# Altium schematic sheet P16 Hi3531AV100(RGMII&I.SchDoc
size 420 x 297 mm
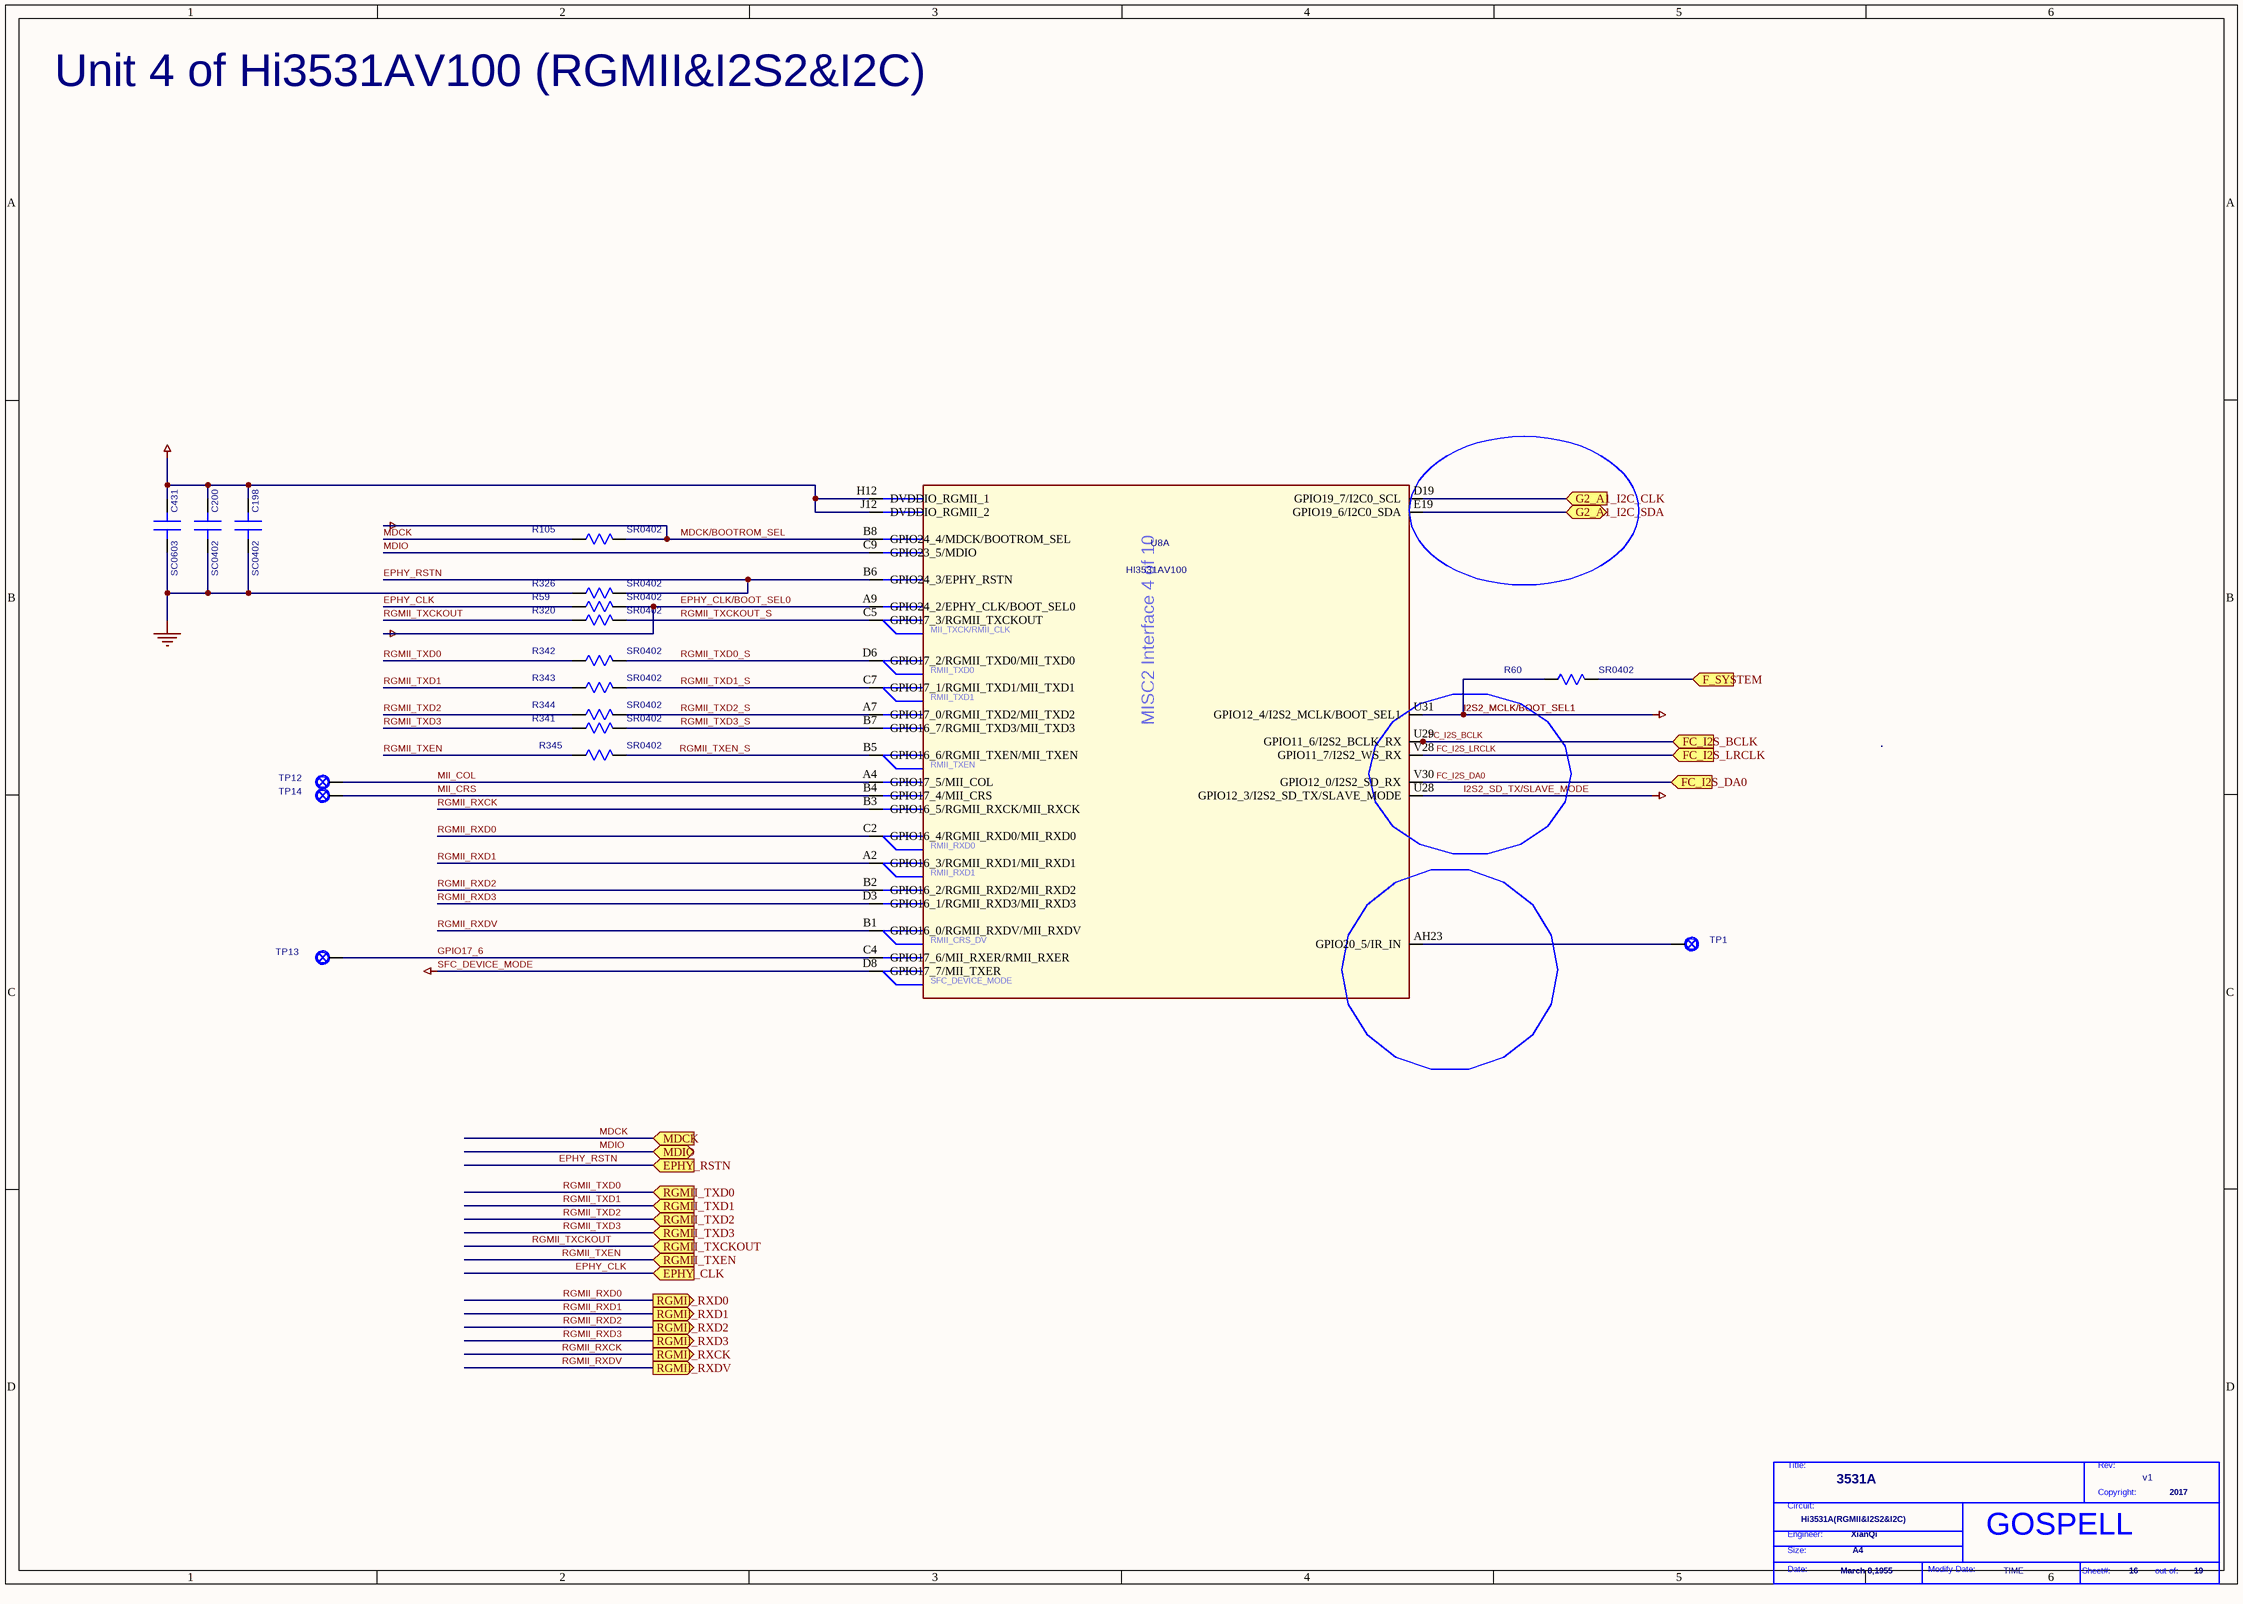
[diagram p0: P16 Hi3531AV100(RGMII&I.SchDoc]

## Parts
*  Page Modify Date: TIME  Engineer: XianQi  Copyright: 2017  Title: 3531A  RevCode: v1  Page Size: A4  Page Create Date: March 8,1955  Page Number: 16  Page Count: 19  Doc: Hi3531A(RGMII&I2S2&I2C)  (hidden comment: GOSPELL)  (graphical)
C198  SC0402  [SC0402]
C200  SC0402  [SC0402]
C431  SC0603  [SC0603]
R59  SR0402  [SR0402]
R60  SR0402  [SR0402]
R105  SR0402  [SR0402]
R320  SR0402  [SR0402]
R326  SR0402  [SR0402]
R341  SR0402  [SR0402]
R342  SR0402  [SR0402]
R343  SR0402  [SR0402]
R344  SR0402  [SR0402]
R345  SR0402  [SR0402]
TP1  TP24-SMD  [TP24-SMD]  (value not drawn)
TP12  TP24-SMD  [TP24-SMD]  (value not drawn)
TP13  TP24-SMD  [TP24-SMD]  (value not drawn)
TP14  TP24-SMD  [TP24-SMD]  (value not drawn)
U8  DEVICE: HI3531AV100  [BGA805-32-3333]  (hidden comment: BGA805-32-3333)  (part A of 10)

## Ports
EPHY_CLK (in), EPHY_RSTN (in), F_SYSTEM (in), FC_I2S_BCLK (in), FC_I2S_DA0 (in), FC_I2S_LRCLK (in), G2_A1_I2C_CLK (in), G2_A1_I2C_SDA (bidir), MDCK (in), MDIO (bidir), RGMII_RXCK (out), RGMII_RXD0 (out), RGMII_RXD1 (out), RGMII_RXD2 (out), RGMII_RXD3 (out), RGMII_RXDV (out), RGMII_TXCKOUT (in), RGMII_TXD0 (in), RGMII_TXD1 (in), RGMII_TXD2 (in), RGMII_TXD3 (in), RGMII_TXEN (in)

## Nets
3V3: C198.1(A) C200.1(A) C431.1(A) U8.H12(DVDDIO_RGMII_1) U8.J12(DVDDIO_RGMII_2)
EPHY_CLK/BOOT_SEL0: R59.2(B) U8.A9(GPIO24_2/EPHY_CLK/BOOT_SEL0)
GND: C198.2(B) C200.2(B) C431.2(B) R326.1(A)
I2S2_MCLK/BOOT_SEL1: R60.1(A) U8.U31(GPIO12_4/I2S2_MCLK/BOOT_SEL1)
I2S2_SD_TX/SLAVE_MODE: U8.U28(GPIO12_3/I2S2_SD_TX/SLAVE_MODE)
MDCK/BOOTROM_SEL: R105.2(B) U8.B8(GPIO24_4/MDCK/BOOTROM_SEL)
SFC_DEVICE_MODE: U8.D8(GPIO17_7/MII_TXER)
EPHY_CLK: R59.1(A) ; port EPHY_CLK
EPHY_RSTN: R326.2(B) U8.B6(GPIO24_3/EPHY_RSTN) ; port EPHY_RSTN
F_SYSTEM: R60.2(B) ; port F_SYSTEM
FC_I2S_BCLK: U8.U29(GPIO11_6/I2S2_BCLK_RX) ; port FC_I2S_BCLK
FC_I2S_DA0: U8.V30(GPIO12_0/I2S2_SD_RX) ; port FC_I2S_DA0
FC_I2S_LRCLK: U8.V28(GPIO11_7/I2S2_WS_RX) ; port FC_I2S_LRCLK
G2_A1_I2C_CLK: U8.D19(GPIO19_7/I2C0_SCL) ; port G2_A1_I2C_CLK
G2_A1_I2C_SDA: U8.E19(GPIO19_6/I2C0_SDA) ; port G2_A1_I2C_SDA
GPIO17_6: TP13.1 U8.C4(GPIO17_6/MII_RXER/RMII_RXER)
MDCK: R105.1(A) ; port MDCK
MDIO: U8.C9(GPIO23_5/MDIO) ; port MDIO
MII_COL: TP12.1 U8.A4(GPIO17_5/MII_COL)
MII_CRS: TP14.1 U8.B4(GPIO17_4/MII_CRS)
RGMII_RXCK: U8.B3(GPIO16_5/RGMII_RXCK/MII_RXCK) ; port RGMII_RXCK
RGMII_RXD0: U8.C2(GPIO16_4/RGMII_RXD0/MII_RXD0) ; port RGMII_RXD0
RGMII_RXD1: U8.A2(GPIO16_3/RGMII_RXD1/MII_RXD1) ; port RGMII_RXD1
RGMII_RXD2: U8.B2(GPIO16_2/RGMII_RXD2/MII_RXD2) ; port RGMII_RXD2
RGMII_RXD3: U8.D3(GPIO16_1/RGMII_RXD3/MII_RXD3) ; port RGMII_RXD3
RGMII_RXDV: U8.B1(GPIO16_0/RGMII_RXDV/MII_RXDV) ; port RGMII_RXDV
RGMII_TXCKOUT: R320.1(A) ; port RGMII_TXCKOUT
RGMII_TXCKOUT_S: R320.2(B) U8.C5(GPIO17_3/RGMII_TXCKOUT)
RGMII_TXD0: R342.1(A) ; port RGMII_TXD0
RGMII_TXD0_S: R342.2(B) U8.D6(GPIO17_2/RGMII_TXD0/MII_TXD0)
RGMII_TXD1: R343.1(A) ; port RGMII_TXD1
RGMII_TXD1_S: R343.2(B) U8.C7(GPIO17_1/RGMII_TXD1/MII_TXD1)
RGMII_TXD2: R344.1(A) ; port RGMII_TXD2
RGMII_TXD2_S: R344.2(B) U8.A7(GPIO17_0/RGMII_TXD2/MII_TXD2)
RGMII_TXD3: R341.1(A) ; port RGMII_TXD3
RGMII_TXD3_S: R341.2(B) U8.B7(GPIO16_7/RGMII_TXD3/MII_TXD3)
RGMII_TXEN: R345.1(A) ; port RGMII_TXEN
RGMII_TXEN_S: R345.2(B) U8.B5(GPIO16_6/RGMII_TXEN/MII_TXEN)
NetTP1_1: TP1.1 U8.AH23(GPIO20_5/IR_IN)

## Notes on the sheet
- Unit 4 of Hi3531AV100 (RGMII&I2S2&I2C)
- (in symbol GOSPELL) Title:; Rev:; Copyright:; Circuit:; Engineer:; Size:; Date:; Modify Date:; Sheet#:; out of:
- (in symbol HI3531AV100_M2_17, part A) MII_TXCK/RMII_CLK; RMII_TXD0; RMII_TXD1; MISC2 Interface 4 of 10; RMII_TXEN; RMII_RXD0; RMII_RXD1; RMII_CRS_DV; SFC_DEVICE_MODE

## Library data of the parts
C198 = C_0_Dup2: PARTS: 1; PINSWAP: (A,B); LEVEL: STD; DEVICE: RMEMK105BJ104KV_FR; OriginalSymbolOrigin: (0,30); %208%%161%%192%%224%%195%%251%%179%%198%: SMD陶瓷电容; COMPONENT_HIGH_MAX: 0.55MM; %182%%238%%182%%168%%185%%164%%215%%247%%181%%231%%209%%185%(V): 16; %195%%232%%202%%246%: SMD陶瓷电容-16V-100NF-+/-10%-X7R-0402-BT; CODE: 8070614; PKG_TYPE: SC0402
C200 = C_0_Dup2: PARTS: 1; PINSWAP: (A,B); LEVEL: STD; DEVICE: RMEMK105BJ104KV_FR; OriginalSymbolOrigin: (0,30); CODE: 8070614; %195%%232%%202%%246%: SMD陶瓷电容-16V-100NF-+/-10%-X7R-0402-BT; %182%%238%%182%%168%%185%%164%%215%%247%%181%%231%%209%%185%(V): 16; COMPONENT_HIGH_MAX: 0.55MM; %208%%161%%192%%224%%195%%251%%179%%198%: SMD陶瓷电容; PKG_TYPE: SC0402
C431 = C_0_Dup2: PARTS: 1; PINSWAP: (A,B); LEVEL: STD; DEVICE: C1608X5R0J106MT0A0E; OriginalSymbolOrigin: (0,30); %208%%161%%192%%224%%195%%251%%179%%198%: SMD陶瓷电容; COMPONENT_HIGH_MAX: 0.9MM; %182%%238%%182%%168%%185%%164%%215%%247%%181%%231%%209%%185%(V): 6.3; %195%%232%%202%%246%: SMD陶瓷电容-6.3V-10000NF-+/-20%-X5R-0603-BT,TS16949; CODE: 8070649; PKG_TYPE: SC0603
R59 R105 R320 R344 = R_1: PARTS: 1; LEVEL: STD; DEVICE: RC0402FR_0733RL; PINSWAP: (A,B); OriginalSymbolOrigin: (10,20); %208%%161%%192%%224%%195%%251%%179%%198%: 片式厚膜电阻器; COMPONENT_HIGH_MAX: 0.4MM; %215%%232%%214%%181%%212%%202%%208%%237%%198%%171%%178%%238%: +/-1%; %182%%238%%182%%168%%185%%166%%194%%202%(W): 0.06; %195%%232%%202%%246%: 片式厚膜电阻器-0.0625W-33OHM-+/-1%-0402; CODE: 7090836; PKG_TYPE: SR0402
R60 R341-R343 R345 = R_1: PARTS: 1; LEVEL: STD; DEVICE: RC0402FR_0733RL; PINSWAP: (A,B); OriginalSymbolOrigin: (10,20); CODE: 7090836; %195%%232%%202%%246%: 片式厚膜电阻器-0.0625W-33OHM-+/-1%-0402; %182%%238%%182%%168%%185%%166%%194%%202%(W): 0.06; %215%%232%%214%%181%%212%%202%%208%%237%%198%%171%%178%%238%: +/-1%; COMPONENT_HIGH_MAX: 0.4MM; %208%%161%%192%%224%%195%%251%%179%%198%: 片式厚膜电阻器; PKG_TYPE: SR0402
R326 = R_1: PARTS: 1; LEVEL: STD; DEVICE: RC0402FR_071KL; PINSWAP: (A,B); OriginalSymbolOrigin: (10,20); %208%%161%%192%%224%%195%%251%%179%%198%: 片式厚膜电阻器; COMPONENT_HIGH_MAX: 0.4MM; %215%%232%%214%%181%%212%%202%%208%%237%%198%%171%%178%%238%: +/-1%; %182%%238%%182%%168%%185%%166%%194%%202%(W): 0.06; %195%%232%%202%%246%: 片式厚膜电阻器-0.0625W-1000OHM-+/-1%-0402-BT; CODE: 7091282; PKG_TYPE: SR0402
TP1 TP12-TP14 = TESTPOINT_0: PARTS: 1; DEVICE: TEST-SMD; LEVEL: STD; OriginalSymbolOrigin: (20,20); PKG_TYPE: TP24-SMD
U8 = HI3531AV100_M2_17: FORWARD_PCB: 1; HETERO: (HI3531AV100_DDR1),(HI3531AV100_DDR2),(HI3531AV100_SYSTEM),(HI3531AV100_AD),(HI3531AV100_VO),(HI3531AV100_M1),(HI3531AV100_M2),(HI3531AV100_POWER),(HI3531AV100_VSS1),(HI3531AV100_VSS2); LEVEL: STD; OriginalSymbolOrigin: (30,630); CaptureCellPackProp: HI3531AV100_M2A; CODE: 35020607; PARTS: 1; PKG_TYPE: BGA805-32-3333